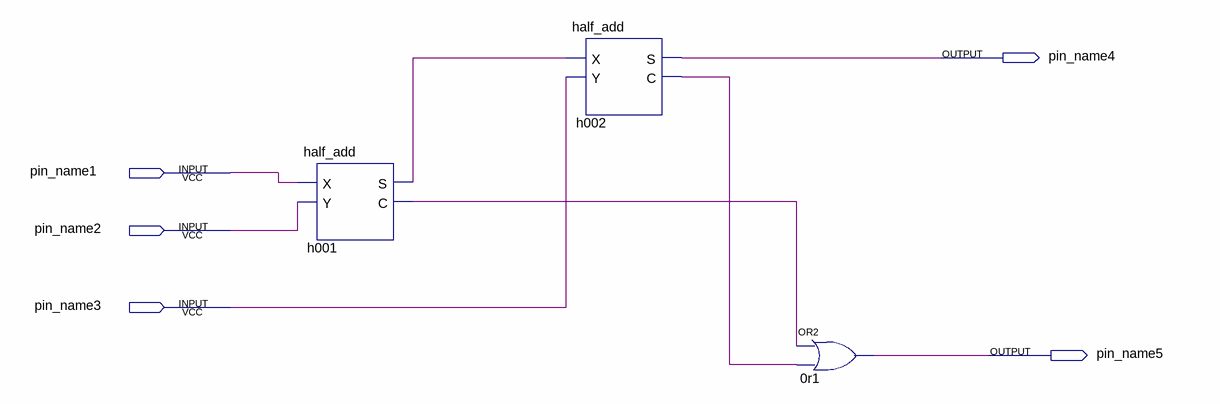
[diagram p0: schematic sheet]
// Quartus schematic adder.bdf as structural Verilog: 3 symbols, 5 pins
module adder (
  input  pin_name1,
  input  pin_name2,
  input  pin_name3,
  output pin_name4,
  output pin_name5
);

  wire h001_c, h001_s, h002_c;

  half_add h001 (.X(pin_name1), .Y(pin_name2), .S(h001_s), .C(h001_c));
  half_add h002 (.X(h001_s), .Y(pin_name3), .S(pin_name4), .C(h002_c));
  or u_0r1 (pin_name5, h001_c, h002_c);
endmodule
